# EasyEDA Pro project ProDocument_CENTER V1_2023-08-07.epro

# Schematic Schematic1_2
Create Date: 2023-04-20; Page Name: P1; Project Name: FS2040_NSPW_FN13101; Schematic Name: Schematic1_2; Update Date: 2023-05-19; Company: EASYEDA; Page Size: A3; Version: V1.0
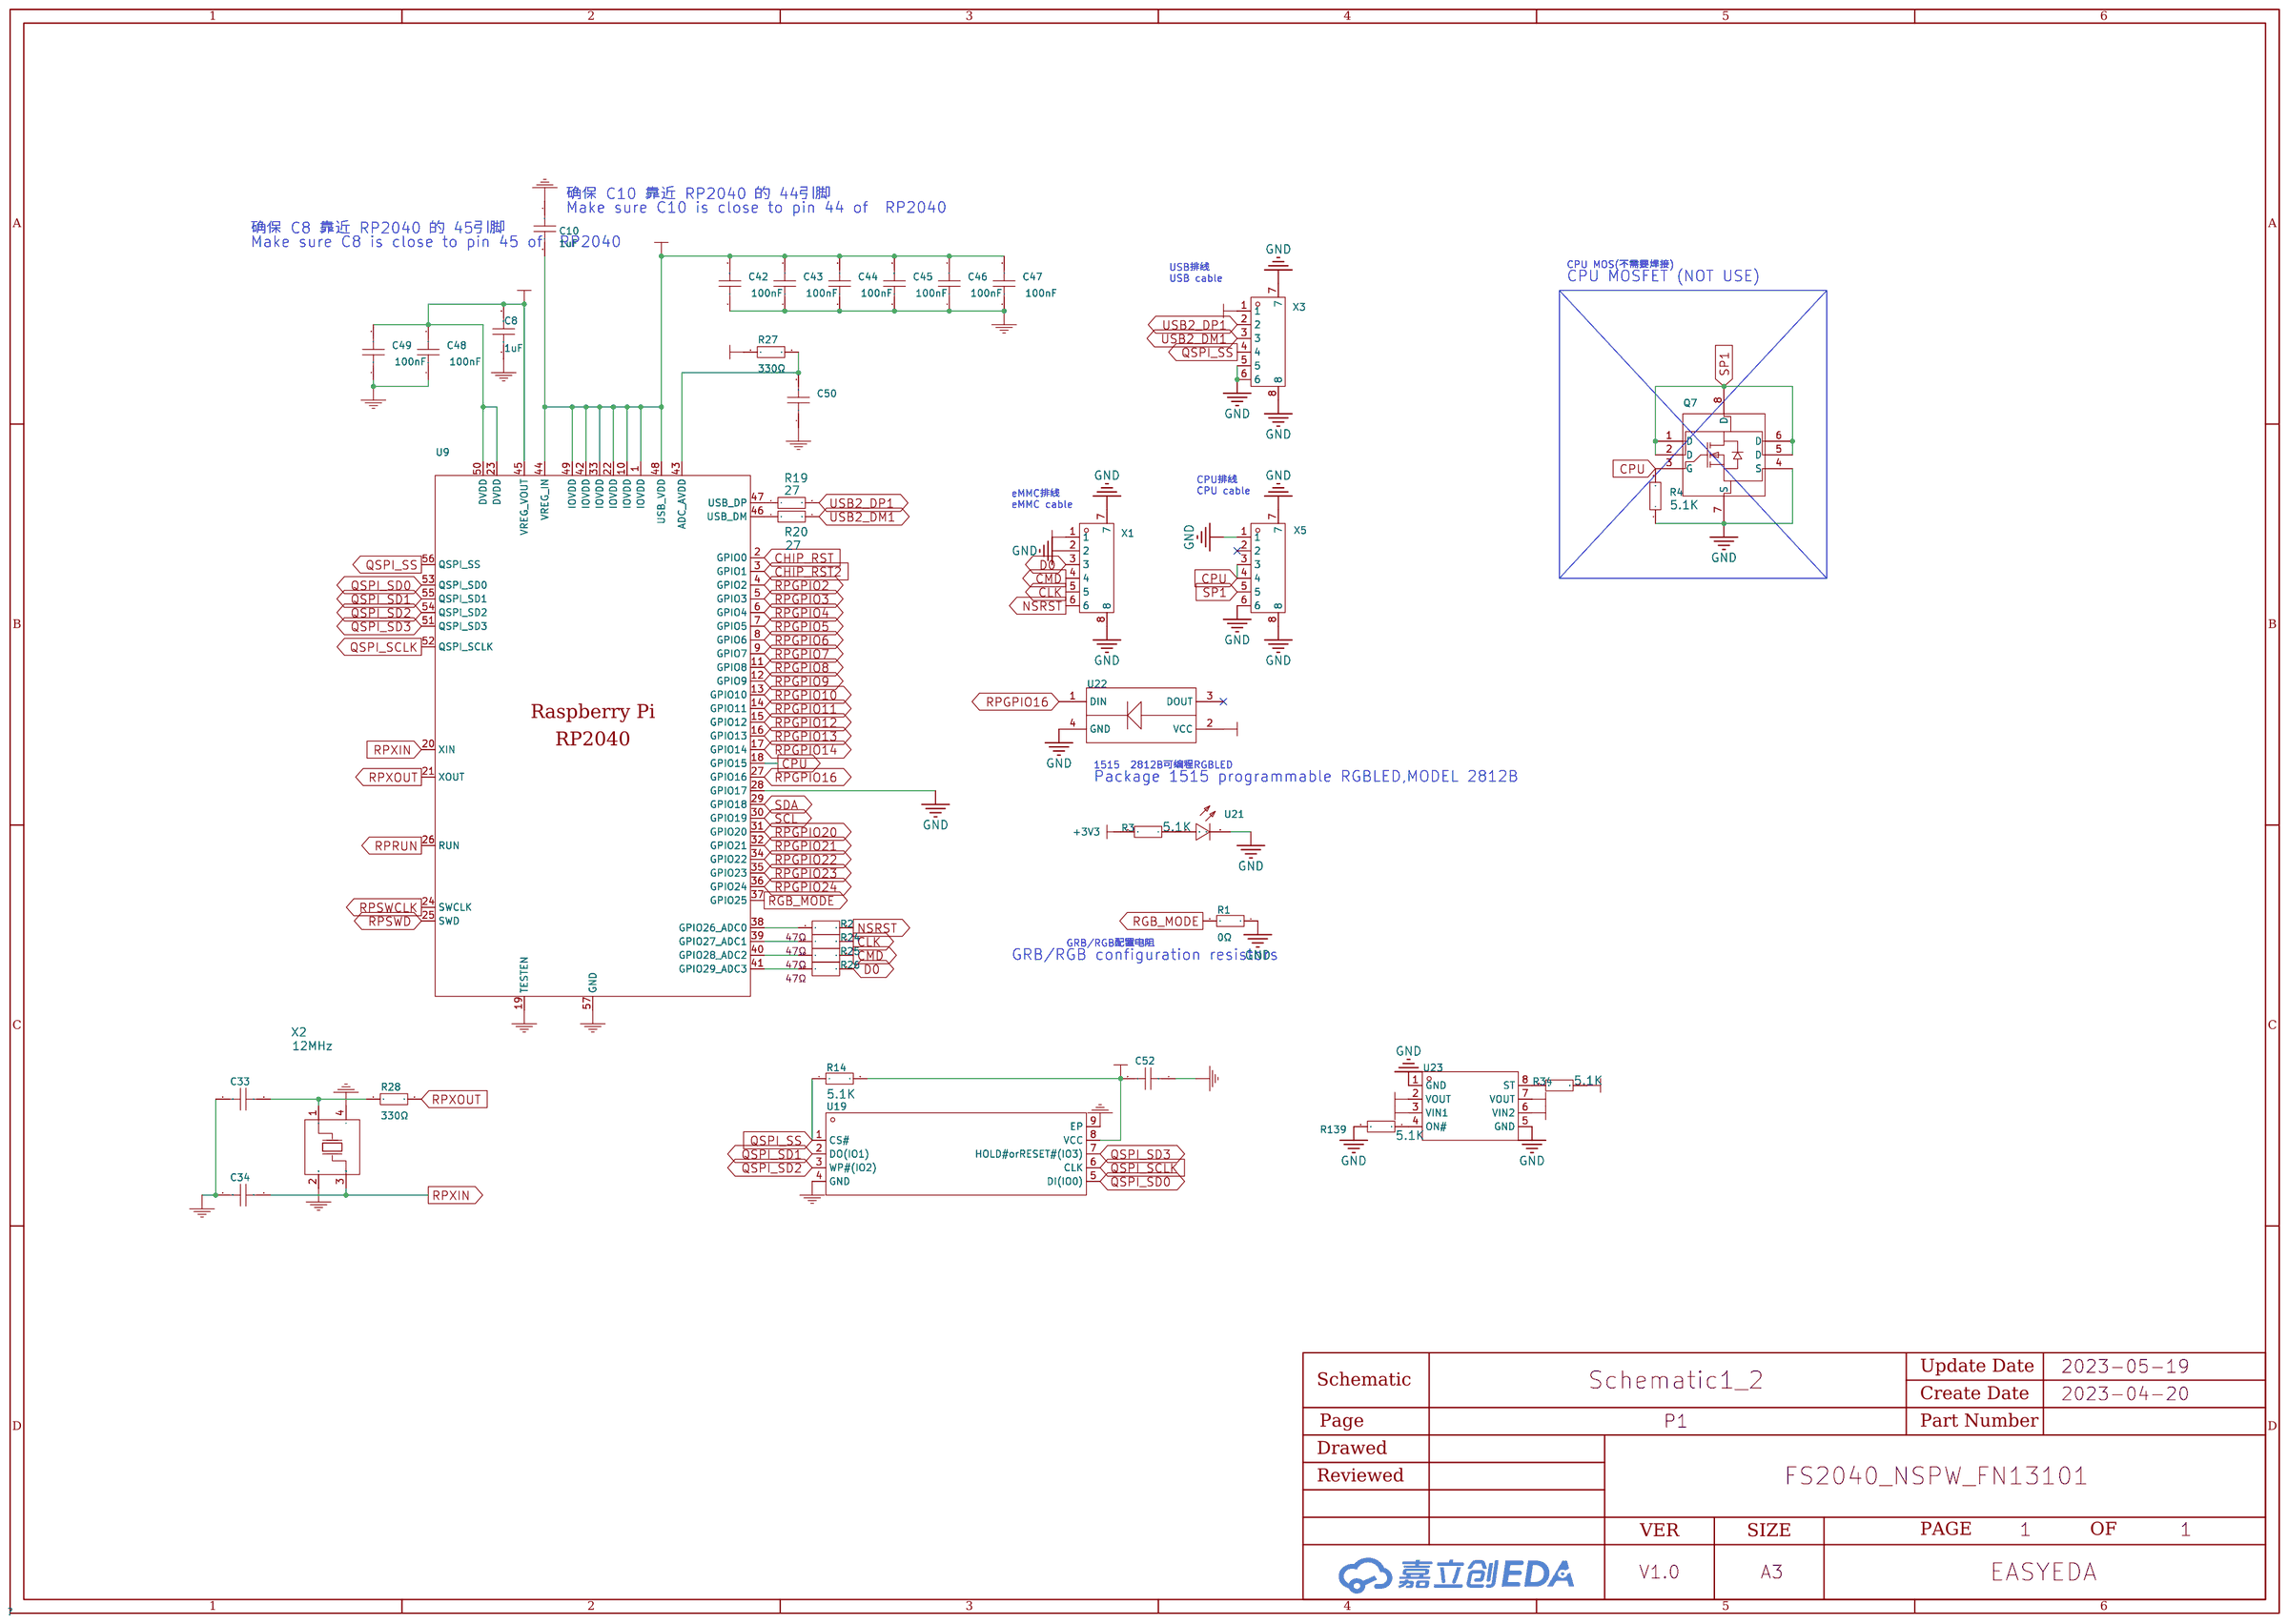
[diagram p0: schematic sheet]

## Parts
C8  1uF  [C0402_FS]
C10  1uF  [C0402_FS]
C33  27pF  [C0402_FS]
C34  27pF  [C0402_FS]
C42  100nF  [C0402_FS]
C43  100nF  [C0402_FS]
C44  100nF  [C0402_FS]
C45  100nF  [C0402_FS]
C46  100nF  [C0402_FS]
C47  100nF  [C0402_FS]
C48  100nF  [C0402_FS]
C49  100nF  [C0402_FS]
C50  100nF  [C0402_FS]
C52  100nF  [C0402_FS]
Q7  IRFHS8342TRPBF  [PQFN-8_L2.0-W2.0-P0.65_IRFHS8342TRPBF]
R1  0Ω  [0R跳线]
R2  ERJ2RKF47R0X  [R0402_FS]
R3  5.1K  [R0402_FS]
R4  5.1K  [R0402_FS]
R14  5.1K  [R0402_FS]
R19  27  [R0402_FS]
R20  27  [R0402_FS]
R24  ERJ2RKF47R0X  [R0402_FS]
R25  ERJ2RKF47R0X  [R0402_FS]
R26  ERJ2RKF47R0X  [R0402_FS]
R27  330Ω  [R0402_FS]
R28  330Ω  [R0402_FS]
R34  5.1K  [R0402_FS]
R139  5.1K  [R0402_FS]
U9  -  [RPI_RP2040]
U19  W25Q16JVUXIQ  [USON-8_L3.0-W2.0-P0.50-BL-EP]
U21  -  [LED 0603_RED]
U22  -  [1515RGB]
U23  LM66200DRLR  [SOT-583-8_L2.1-W1.2-P0.50-LS1.6-BL]
X1  FH34SRJ-6S-0.5SH(50)  [FFC-SMD_6P-P0.50_FH34SRJ-6S-0.5SH]
X2  12MHz  [OSC-SMD_4P-L3.2-W2.5-BL]
X3  FH34SRJ-6S-0.5SH(50)  [FFC-SMD_6P-P0.50_FH34SRJ-6S-0.5SH]
X5  FH34SRJ-6S-0.5SH(50)  [FFC-SMD_6P-P0.50_FH34SRJ-6S-0.5SH]

## Library data of the parts
C8 C10 = GRM155B30J105KE18D: Supplier: LCSC; Manufacturer: MuRata; Supplier Part: C85950
C33 C34 = CL05C270JB5NNNC: 容值:27pF;精度:±5%;额定电压:50V;材质(温度系数):C0G;; LCSC Part Name: 27pF ±5% 50V; Supplier Part: C86287; Manufacturer: SAMSUNG(三星); Supplier Footprint: 0402; JLCPCB Part Class: Extended Part; Datasheet: https://atta.szlcsc.com/upload/public/pdf/source/20181012/C86287_84E643B919F15D04554BF25D05EF9A53.pdf; Supplier: LCSC; Tolerance: ±5%; Voltage Rated: 50V; Temperature Coefficient: C0G
C42-C50 C52 = CC0402KRX7R5BB104: 温度系数:X7R;额定电压:6.3V;容值:100nF;电容体长:-;精度:±10%;电容体宽:-;电容体厚度:-;; LCSC Part Name: 100nF ±10% 6.3V; Supplier Part: C541406; Manufacturer: YAGEO(国巨); Supplier Footprint: 0402; JLCPCB Part Class: 扩展库; Datasheet: https://atta.szlcsc.com/upload/public/pdf/source/20200615/C541406_3B194383538E3D589FF46A58415A779C.pdf; Supplier: LCSC; Temperature Coefficient: X7R; Voltage Rated: 6.3V; Tolerance: ±10%
Q7 = IRFHS8342TRPBF: 类型:-;漏源电压(Vdss):-;连续漏极电流(Id):-;功率(Pd):-;导通电阻(RDS(on)@Vgs,Id):-;阈值电压(Vgs(th)@Id):-;栅极电荷(Qg@Vgs):-;输入电容(Ciss@Vds):-;反向传输电容(Crss@Vds):-;; Supplier Part: C537911; Manufacturer: Infineon(英飞凌); Supplier Footprint: PG-TSDSON-6; JLCPCB Part Class: Extended Part; Datasheet: https://atta.szlcsc.com/upload/public/pdf/source/20200522/C537911_B3BB2E0FBE18C9ED8D5A499E93241CA4.pdf; Supplier: LCSC
R1 = 0402WGF0000TCE: 电阻类型:厚膜电阻;阻值:0Ω;精度:±1%;功率:62.5mW;温度系数:±800ppm/℃;最大工作电压:50V;工作温度范围:-55℃~+155℃;; LCSC Part Name: 0Ω ±1% 62.5mW; Supplier Part: C17168; Manufacturer: UNI-ROYAL(厚声); Supplier Footprint: 0402; JLCPCB Part Class: 基础库; Datasheet: https://atta.szlcsc.com/upload/public/pdf/source/20200306/C422600_1E6D84923E4A46A82E41ADD87F860B5C.pdf; Supplier: LCSC; Type: 厚膜电阻; Tolerance: ±1%; Power(Watts): 62.5mW; Temperature Coefficient: ±800ppm/℃; Overload Voltage (Max): 50V; Operating Temperature Range: -55℃~+155℃
R2 R24-R26 = ERJ2RKF47R0X: LCSC Part Name: 47Ω; Supplier Part: C413056; Manufacturer: PANASONIC(松下); Supplier Footprint: 0402; JLCPCB Part Class: 扩展库; Datasheet: https://atta.szlcsc.com/upload/public/pdf/source/20190820/C413056_058CD750093394CDC09CF9CD7D90936D.pdf; Supplier: LCSC
R3 R4 R14 R34 R139 = RMC04025.1K1%N: 阻值:5.1kΩ;精度:±1%;功率:62.5mW;; LCSC Part Name: 5.1kΩ ±1% 62.5mW; Supplier Part: C325521; Manufacturer: Tyohm(幸亚电阻); Supplier Footprint: 0402; JLCPCB Part Class: Extended Part; Datasheet: https://atta.szlcsc.com/upload/public/pdf/source/20190115/C325521_1EC5F156994D781C7E2B08432302F19F.pdf; Supplier: LCSC; Tolerance: ±1%; Power(Watts): 62.5mW
R19 R20 = 0402WGF270JTCE: Supplier: LCSC; Manufacturer: UniOhm; Supplier Part: C25100; JLCPCB Part Class: Extended Part
R27 R28 = 0402WGF3300TCE: 阻值:330Ω;精度:±1%;功率:1/16W;温度系数:±100ppm/℃;最大工作电压:50V;工作温度范围:-55℃~+155℃;; LCSC Part Name: 330Ω ±1%; Supplier Part: C25104; Manufacturer: UNI-ROYAL(厚声); Supplier Footprint: 0402; JLCPCB Part Class: 基础库; Datasheet: https://atta.szlcsc.com/upload/public/pdf/source/20170920/C25104_1505901212369982735.pdf; Supplier: LCSC; Tolerance: ±1%; Power(Watts): 1/16W; Temperature Coefficient: ±100ppm/℃; Overload Voltage (Max): 50V; Operating Temperature Range: -55℃~+155℃
U9 = RPI_RP2040: Supplier: LCSC; Supplier Part: C2040; Manufacturer: Raspberry Pi(树莓派); Manufacturer Part: RP2040; JLCPCB Part Class: Extended Part
U19 = W25Q16JVUXIQ: Supplier Part: C2843335; Manufacturer: WINBOND(华邦); Supplier Footprint: USON-8; JLCPCB Part Class: 扩展库; Datasheet: https://atta.szlcsc.com/upload/public/pdf/source/20210629/C2843335_FB4D78B5076715625DC0C83F790D3044.pdf; Supplier: LCSC
U21 = LED 0603
U22 = 1515RGB
U23 = LM66200DRLR: Supplier Part: C3235556; Manufacturer: TI(德州仪器); Supplier Footprint: SOT-583; JLCPCB Part Class: Extended Part; Supplier: LCSC
X1 X3 X5 = FH34SRJ-6S-0.5SH(50): 间距:0.5mm;触点数量:6;锁定特性:-;安装类型:卧贴;触点类型:双侧触点/上下接;; Supplier Part: C224194; Manufacturer: HRS(广濑); Supplier Footprint: SMD; JLCPCB Part Class: Extended Part; Datasheet: https://atta.szlcsc.com/upload/public/pdf/source/20180712/C224194_08937A353F43080B85824A8384727686.pdf; Supplier: LCSC; Pitch: 0.5mm; Number of Contacts: 6; Mounting Type: 卧贴; Contact Type: 双侧触点/上下接; Height Above Board: 1mm; FFC, FCB Thickness: 0.3mm~0.3mm
X2 = -: Supplier: LCSC; Supplier Part: C362368; Manufacturer: Zhejiang Abel Elec; JLCPCB Part Class: Extended Part

## Nets
+1V1: C8.2 C48.2 C49.2 U9.23(DVDD) U9.45(VREG_VOUT) U9.50(DVDD)
+3V3: C10.2 C42.2 C43.2 C44.2 C45.2 C46.2 C47.2 C52.2 R3.2 R14.2 R27.1 U9.1(IOVDD) U9.10(IOVDD) U9.22(IOVDD) U9.33(IOVDD) U9.42(IOVDD) U9.44(VREG_IN) U9.48(USB_VDD) U9.49(IOVDD) U19.8(VCC) U22.2(VCC) U23.2(VOUT) U23.7(VOUT)
+3V3EMMC: R34.1 U23.3(VIN1) X1.1
+3V3INUSB: U23.6(VIN2) X3.1
GND: C8.1 C10.1 C33.2 C34.2 C42.1 C43.1 C44.1 C45.1 C46.1 C47.1 C48.1 C49.1 C50.1 C52.1 Q7.4(S) Q7.7(S) R1.1 R4.1 R139.2 U9.19(TESTEN) U9.28(GPIO17) U9.57(GND) U19.4(GND) U19.9(EP) U21.2(C) U22.4(GND) U23.1(GND) U23.5(GND) X1.2 X1.7 X1.8 X2.2 X2.4 X3.5 X3.6 X3.7 X3.8 X5.1 X5.6 X5.7 X5.8
CHIP_RST: U9.2(GPIO0)
CHIP_RST2: U9.3(GPIO1)
CLK: R24.2 X1.5
CMD: R25.2 X1.4
CPU: Q7.3(G) R4.2 U9.18(GPIO15) X5.3 X5.4
D0: R26.2 X1.3
NSRST: R2.2 X1.6
QSPI_SCLK: U9.52(QSPI_SCLK) U19.6(CLK)
QSPI_SD0: U9.53(QSPI_SD0) U19.5(DI(IO0))
QSPI_SD1: U9.55(QSPI_SD1) U19.2(DO(IO1))
QSPI_SD2: U9.54(QSPI_SD2) U19.3(WP#(IO2))
QSPI_SD3: U9.51(QSPI_SD3) U19.7(HOLD#orRESET#(IO3))
QSPI_SS: R14.1 U9.56(QSPI_SS) U19.1(CS#) X3.4
RGB_MODE: R1.2 U9.37(GPIO25)
RPGPIO2: U9.4(GPIO2)
RPGPIO3: U9.5(GPIO3)
RPGPIO4: U9.6(GPIO4)
RPGPIO5: U9.7(GPIO5)
RPGPIO6: U9.8(GPIO6)
RPGPIO7: U9.9(GPIO7)
RPGPIO8: U9.11(GPIO8)
RPGPIO9: U9.12(GPIO9)
RPGPIO10: U9.13(GPIO10)
RPGPIO11: U9.14(GPIO11)
RPGPIO12: U9.15(GPIO12)
RPGPIO13: U9.16(GPIO13)
RPGPIO14: U9.17(GPIO14)
RPGPIO16: U9.27(GPIO16) U22.1(DIN)
RPGPIO20: U9.31(GPIO20)
RPGPIO21: U9.32(GPIO21)
RPGPIO22: U9.34(GPIO22)
RPGPIO23: U9.35(GPIO23)
RPGPIO24: U9.36(GPIO24)
RPRUN: U9.26(RUN)
RPSWCLK: U9.24(SWCLK)
RPSWD: U9.25(SWD)
RPXIN: C34.1 U9.20(XIN) X2.3(OSC2)
RPXOUT: R28.1 U9.21(XOUT)
SCL: U9.30(GPIO19)
SDA: U9.29(GPIO18)
SP1: Q7.1(D) Q7.2(D) Q7.5(D) Q7.6(D) Q7.8(D) X5.5
USB2_DM1: R20.2 X3.3
USB2_DP1: R19.2 X3.2
$1N4246: C33.1 R28.2 X2.1(OSC1)
$1N4249: C50.2 R27.2 U9.43(ADC_AVDD)
$1N4262: R19.1 U9.47(USB_DP)
$1N4263: R20.1 U9.46(USB_DM)
$1N6328: R26.1 U9.41(GPIO29_ADC3)
$1N6330: R25.1 U9.40(GPIO28_ADC2)
$1N6332: R24.1 U9.39(GPIO27_ADC1)
$1N18439: R2.1 U9.38(GPIO26_ADC0)
$1N32117: R3.1 U21.1(A)
$1N46651: R139.1 U23.4(ON#)
$1N46695: R34.2 U23.8(ST)

Not connected (* = marked no-connect by the designer): U22 3(DOUT)*; X5 2*

## Notes on the sheet
- 确保 C10 靠近 RP2040 的 44引脚
- Make sure C10 is close to pin 44 of  RP2040
- 确保 C8 靠近 RP2040 的 45引脚
- Make sure C8 is close to pin 45 of  RP2040
- CPU MOS(不需要焊接)
- USB排线
  USB cable
- CPU MOSFET (NOT USE)
- CPU排线
  CPU cable
- eMMC排线
  eMMC cable
- 1515  2812B可编程RGBLED
- Package 1515 programmable RGBLED,MODEL 2812B
- GRB/RGB配置电阻
- GRB/RGB configuration resistors

# Board PCB1_2
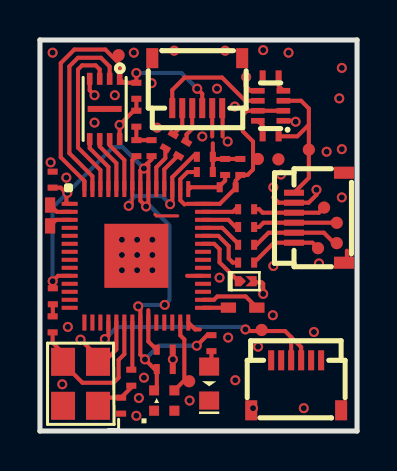
[diagram p1: board, top side]
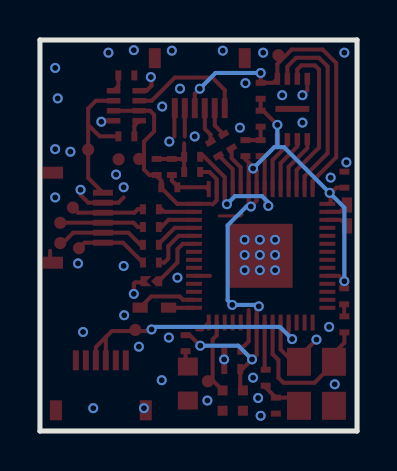
[diagram p2: board, bottom side, seen from below]

Outline 15.88 x 19.56 mm; copper layers: Top Layer, Bottom Layer. Coordinates in mm from the lower left corner of the outline.
Outline path: 0,19.56 0,0 15.88,0 15.88,19.56 0,19.56
Stack: Top Layer 0.035mm / Dielectric1 0.03mm FR4 er 4.5 / Bottom Layer 0.035mm

## Design rules (mm)
net $1N4262: DP1
net USB2_DP1: DP2
net $1N4263: DP1
net USB2_DM1: DP2
template: 用户自定义配置
spacing safeClearance (default): track to track 0.152, other pairs 0 to 0.3
track width trackWidth (default): min 0.127, default 0.254, max 2.54
differential pair differentialPair (default): width min 0.127, default 0.254, max 2.54; gap min 0.152, default 0.152
via viaSize (default): diameter min 0.5, default 0.61, max 10; hole min 0.3, default 0.305, max 5.999

## Placement (name value [footprint] x y rotation side)
C8  1uF  [C0402_FS]  8.26 13.72 180 top
C10  1uF  [C0402_FS]  8.26 12.95 180 top
C33  27pF  [C0402_FS]  4.06 1.27 270 top
C34  27pF  [C0402_FS]  0.64 5.33 90 top
C42  100nF  [C0402_FS]  0.64 12.57 270 top
C43  100nF  [C0402_FS]  0.65 6.74 90 top
C44  100nF  [C0402_FS]  10.03 13.21 270 top
C46  100nF  [C0402_FS]  6.25 3.1 180 top
C47  100nF  [C0402_FS]  5.59 14.15 270 top
C48  100nF  [C0402_FS]  6.25 4.06 180 top
C49  100nF  [C0402_FS]  4.83 14.15 270 top
C50  100nF  [C0402_FS]  9.27 13.21 270 top
C52  100nF  [C0402_FS]  4.83 15.62 90 top
NOREF  -  [Pad_e3163]  3.94 18.8 0 top
NOREF#2  -  [Pad_e3547]  13.92 9.14 0 top
NOREF#3  -  [Pad_e2963]  13.46 14.07 0 top
NOREF#4  -  [Pad_e3544]  14.22 11.18 0 top
NOREF#5  -  [Pad_e3545]  14.86 10.41 0 top
NOREF#6  -  [Pad_e2970]  11.94 13.59 0 top
NOREF#7  -  [Pad_e1245]  0.51 11.3 90 top
NOREF#8  -  [Pad_e2974]  7.47 2.49 0 top
NOREF#9  -  [Pad_e1214]  10.86 6.17 180 top
NOREF#10  -  [Pad_e1216]  9.44 6.17 180 top
NOREF#11  -  [Pad_e3546]  14.86 9.4 0 top
NOREF#12  -  [Pad_e2969]  10.91 13.61 0 top
NOREF#13  -  [Pad_e2972]  11.1 5.05 0 top
NOREF#14  -  [Pad_e1246]  0.51 10.26 90 top
R1  0Ω  [0R跳线]  10.29 7.49 180 top
R2  ERJ2RKF47R0X  [R0402_FS]  10.32 8.43 0 top
R3  5.1K  [R0402_FS]  8.59 4.39 90 top
R14  5.1K  [R0402_FS]  4.83 17.02 270 top
R19  27  [R0402_FS]  6.48 14.49 60 top
R20  27  [R0402_FS]  7.14 14.11 60 top
R24  ERJ2RKF47R0X  [R0402_FS]  10.32 9.31 0 top
R25  ERJ2RKF47R0X  [R0402_FS]  10.32 10.2 0 top
R26  ERJ2RKF47R0X  [R0402_FS]  10.32 11.09 0 top
R27  330Ω  [R0402_FS]  9.4 12.19 180 top
R28  330Ω  [R0402_FS]  4.57 2.67 270 top
R34  5.1K  [R0402_FS]  11.55 14.74 180 top
R139  5.1K  [R0402_FS]  11.55 17.79 180 top
U9  -  [RPI_RP2040]  4.83 8.76 0 top
U19  W25Q16JVUXIQ  [USON-8_L3.0-W2.0-P0.50-BL-EP]  3.24 16.11 180 top
U21  -  [LED 0603_RED]  8.47 2.37 270 top
U22  -  [1515RGB]  6.22 1.52 180 top
U23  LM66200DRLR  [SOT-583-8_L2.1-W1.2-P0.50-LS1.6-BL]  11.55 16.27 90 top
X1  FH34SRJ-6S-0.5SH(50)  [FFC-SMD_6P-P0.50_FH34SRJ-6S-0.5SH]  13.97 10.67 90 top
X2  12MHz  [OSC-SMD_4P-L3.2-W2.5-BL]  2.03 2.36 90 top
X3  FH34SRJ-6S-0.5SH(50)  [FFC-SMD_6P-P0.50_FH34SRJ-6S-0.5SH]  7.87 17.4 180 top
X5  FH34SRJ-6S-0.5SH(50)  [FFC-SMD_6P-P0.50_FH34SRJ-6S-0.5SH]  12.83 2.29 0 top

## Footprints (pads in the part's own frame, mm; a bottom-side part is the same pattern mirrored in y, then rotated)
0R跳线
  custom 0.559x0.508 smd: 1(-0.28,0) 2(0.254,0)
1515RGB
  rect 0.5x0.5 smd: 1(-0.508,-0.508) 2(0.508,-0.508) 3(0.508,0.508) 4(-0.508,0.508)
C0402_FS
  rect 0.3x0.5 smd: 1(-0.4,0) 2(0.4,0)
FFC-SMD_6P-P0.50_FH34SRJ-6S-0.5SH
  rect 0.3x1 smd: 1(1.25,1.25) 2(0.75,1.25) 3(0.25,1.25) 4(-0.25,1.25) 5(-0.75,1.25) 6(-1.25,1.25)
  rect 0.6x1 smd: 7(-2.25,-1.25) 8(2.25,-1.25)
LED 0603_RED
  rect 0.9x1 smd: 1(-0.85,0) 2(0.85,0)
OSC-SMD_4P-L3.2-W2.5-BL
  rect 1.4x1.2 smd: 1(-1.1,-0.875) 2(1.1,-0.875) 3(1.1,0.875) 4(-1.1,0.875)
Pad_e1214
  rect 0.762x0.508 smd: 1(0,0)
Pad_e1216
  rect 0.762x0.508 smd: 1(0,0)
Pad_e1245
  rect 0.762x0.508 smd: 1(0,0)
Pad_e1246
  rect 0.762x0.508 smd: 1(0,0)
Pad_e2963
  round 0.61 smd: TP1(0,0)
Pad_e2969
  round 0.61 smd: TP2(0,0)
Pad_e2970
  round 0.61 smd: TP3(0,0)
Pad_e2972
  round 0.61 smd: TP5(0,0)
Pad_e2974
  round 0.61 smd: TP7(0,0)
Pad_e3163
  round 0.61 smd: TP9(0,0)
Pad_e3544
  round 0.61 smd: TP11(0,0)
Pad_e3545
  round 0.61 smd: TP12(0,0)
Pad_e3546
  round 0.61 smd: TP13(0,0)
Pad_e3547
  round 0.61 smd: TP14(0,0)
R0402_FS
  rect 0.3x0.5 smd: 1(-0.4,0) 2(0.4,0)
RPI_RP2040
  rect 0.8x0.2 smd: 1(-3.338,2.6) 2(-3.338,2.2) 3(-3.338,1.8) 4(-3.338,1.4) 5(-3.338,1) 6(-3.338,0.6) 7(-3.338,0.2) 8(-3.338,-0.2) 9(-3.338,-0.6) 10(-3.338,-1) 11(-3.338,-1.4) 12(-3.338,-1.8) 13(-3.338,-2.2) 14(-3.338,-2.6) 29(3.338,-2.6) 30(3.338,-2.2) 31(3.338,-1.8) 32(3.338,-1.4) 33(3.338,-1) 34(3.338,-0.6) 35(3.338,-0.2) 36(3.338,0.2) 37(3.338,0.6) 38(3.338,1) 39(3.338,1.4) 40(3.338,1.8) 41(3.338,2.2) 42(3.338,2.6)
  rect 0.2x0.8 smd: 15(-2.6,-3.338) 16(-2.2,-3.338) 17(-1.8,-3.338) 18(-1.4,-3.338) 19(-1,-3.338) 20(-0.6,-3.338) 21(-0.2,-3.338) 22(0.2,-3.338) 23(0.6,-3.338) 24(1,-3.338) 25(1.4,-3.338) 26(1.8,-3.338) 27(2.2,-3.338) 28(2.6,-3.338) 43(2.6,3.338) 44(2.2,3.338) 45(1.8,3.338) 46(1.4,3.338) 47(1,3.338) 48(0.6,3.338) 49(0.2,3.338) 50(-0.2,3.338) 51(-0.6,3.338) 52(-1,3.338) 53(-1.4,3.338) 54(-1.8,3.338) 55(-2.2,3.338) 56(-2.6,3.338)
  rect 3.2x3.2 smd: 57(0,0)
SOT-583-8_L2.1-W1.2-P0.50-LS1.6-BL
  rect 0.28x0.68 smd: 1(-0.75,-0.64) 2(-0.25,-0.64) 3(0.25,-0.64) 4(0.75,-0.64) 5(0.75,0.64) 6(0.25,0.64) 7(-0.25,0.64) 8(-0.75,0.64)
USON-8_L3.0-W2.0-P0.50-BL-EP
  rect 0.28x0.6 smd: 1(-0.75,-1.506) 2(-0.249,-1.506) 3(0.249,-1.506) 4(0.75,-1.506) 5(0.75,1.509) 6(0.249,1.509) 7(-0.249,1.509) 8(-0.75,1.509)
  rect 1.7x0.299 smd: 9(0,0)

## Nets
+1V1: C8.2 C48.2 C49.2 U9.23 U9.45 U9.50
+3V3: C10.2 C42.2 C43.2 C44.2 C46.2 C47.2 C52.2 NOREF#12.TP2 R3.2 R14.2 R27.1 U9.1 U9.10 U9.22 U9.33 U9.42 U9.44 U9.48 U9.49 U19.8 U22.2 U23.2 U23.7
+3V3EMMC: NOREF#3.TP1 R34.1 U23.3 X1.1
+3V3INUSB: U23.6 X3.1
GND: C8.1 C10.1 C33.2 C34.2 C42.1 C43.1 C44.1 C46.1 C47.1 C48.1 C49.1 C50.1 C52.1 NOREF#6.TP3 R1.1 R139.2 U9.19 U9.28 U9.57 U19.4 U19.9 U21.2 U22.4 U23.1 U23.5 X1.2 X1.7 X1.8 X2.2 X2.4 X3.5 X3.6 X3.7 X3.8 X5.1 X5.6 X5.7 X5.8
CHIP_RST: NOREF#7.1 U9.2
CHIP_RST2: NOREF#14.1 U9.3
CLK: NOREF#11.TP13 R24.2 X1.5
CMD: NOREF#5.TP12 R25.2 X1.4
CPU: NOREF#13.TP5 U9.18 X5.3 X5.4
D0: NOREF#4.TP11 R26.2 X1.3
NSRST: NOREF#2.TP14 R2.2 X1.6
QSPI_SCLK: U9.52 U19.6
QSPI_SD0: U9.53 U19.5
QSPI_SD1: U9.55 U19.2
QSPI_SD2: U9.54 U19.3
QSPI_SD3: U9.51 U19.7
QSPI_SS: NOREF.TP9 R14.1 U9.56 U19.1 X3.4
RGB_MODE: R1.2 U9.37
RPGPIO2: U9.4
RPGPIO3: U9.5
RPGPIO4: U9.6
RPGPIO5: U9.7
RPGPIO6: U9.8
RPGPIO7: U9.9
RPGPIO8: U9.11
RPGPIO9: U9.12
RPGPIO10: U9.13
RPGPIO11: U9.14
RPGPIO12: U9.15
RPGPIO13: U9.16
RPGPIO14: U9.17
RPGPIO16: NOREF#8.TP7 U9.27 U22.1
RPGPIO20: U9.31
RPGPIO21: U9.32
RPGPIO22: U9.34
RPGPIO23: U9.35
RPGPIO24: U9.36
RPRUN: U9.26
RPSWCLK: U9.24
RPSWD: U9.25
RPXIN: C34.1 U9.20 X2.3
RPXOUT: R28.1 U9.21
SCL: NOREF#9.1 U9.30
SDA: NOREF#10.1 U9.29
SP1: X5.5
USB2_DM1: R20.2 X3.3
USB2_DP1: R19.2 X3.2
$1N4246: C33.1 R28.2 X2.1
$1N4249: C50.2 R27.2 U9.43
$1N4262: R19.1 U9.47
$1N4263: R20.1 U9.46
$1N6328: R26.1 U9.41
$1N6330: R25.1 U9.40
$1N6332: R24.1 U9.39
$1N18439: R2.1 U9.38
$1N32117: R3.1 U21.1
$1N46651: R139.1 U23.4
$1N46695: R34.2 U23.8

Pads without a net: U22 3; X5 2

## Via types
v1: diameter 0.5, hole 0.3, Top Layer to Bottom Layer, 70 vias

## Routing (per net, layer and track width the routed paths; a pad name or vN(x,y) marks a point on that pad's centre or on a via; arc(x,y) is an arc through that point)
+1V1: length 10.4
  Top Layer w0.152: 4.63,12.1 4.62,11.34 4.36,11.34
  Top Layer w0.203: v1(6.52,11.34) 6.63,11.45 U9.45 6.63,12.7 7.73,13.8 ; 5.85,4.07 5.84,4.07 5.43,4.48 U9.23 5.43,6.05 ; C49.2 4.63,13.55 4.63,12.06
  Bottom Layer w0.203: v1(4.44,11.26) 4.44,11.43 4.75,11.75 6.12,11.75 v1(6.52,11.34)
+3V3: length 50.4
  Top Layer w0.152: 6.9,10.76 5.83,10.76 5.75,10.84
  Top Layer w0.203: 7.37,11.36 U9.42 9,11.36 9.8,12.16 9.8,12.52 10.03,12.75 C44.2 10.4,12.81 10.67,13.08 10.67,14.48 10.16,14.99 10.16,15.82 10.36,16.02 U23.7 U23.2 ; 8.13,7.76 7.37,7.76 ; v1(4.92,6.24) 5.03,6.13 U9.22 5.03,3.81 v1(5.26,3.58) 5.74,3.1 5.85,3.1 5.85,2.17 U22.2 ; 5.36,13.36 5.43,13.3 U9.48 5.43,11.34 v1(5.31,11.23) 5.03,11.52 U9.49 5.03,13.03 5.36,13.36 ; 5.36,13.36 5.59,13.59 C47.2 ; U19.8 v1(3.99,15.31) 4.7,16.02 C52.2 R14.2 ; v1(7.85,4.27) 8.38,4.79 R3.2 ; C42.2 1.04,12.17 1.32,11.88 1.32,11.44 1.4,11.36 1.53,11.36 ; 7.73,12.95 7.39,12.95 7.03,12.59 U9.44 7.03,11.54 7.24,11.33 ; C43.2 0.64,7.15 v1(0.64,7.49) 0.91,7.76 1.53,7.76
  Bottom Layer w0.203: v1(5.21,13.13) 4.14,14.2 3.99,14.2 ; v1(4.92,6.24) 4.99,6.31 v1(6.25,6.31) 6.48,6.54 6.48,10.29 5.54,11.23 v1(5.31,11.23) ; 3.99,14.2 3.66,14.2 v1(1.37,11.91) 0.64,11.18 v1(0.64,7.49) ; 3.99,14.2 v1(3.99,15.31) ; v1(5.26,3.58) 5.94,4.27 v1(7.85,4.27)
+3V3EMMC: length 7.7
  Top Layer w0.203: U23.3 13.07,16.52 13.46,16.13 13.46,15.32 ; 13.46,15.32 12.88,14.74 R34.1 ; 13.46,15.32 NOREF#3.TP1 13.46,12.66 X1.1
+3V3INUSB: length 5.9
  Top Layer w0.203: X3.1 6.62,17.06 7.25,17.68 9.12,17.68 10.28,16.52 U23.6
GND: length 20.4
  Top Layer w0.203: 15.37,9.02 15.37,8.56 X1.7 ; C52.1 C49.1 C47.1 ; v1(2.73,16.8) 2.49,17.04 U19.4 ; 6.65,3.73 C48.1 ; 3.83,5.46 3.83,4.08 2.91,3.16 2.91,3.7 v1(2.03,4.57) ; 11.68,11.68 11.95,11.42 X1.2 13.45,11.42 13.84,11.81 v1(13.84,12.06) ; X3.5 8.62,14.73 ; C43.1 0.65,5.74 C34.2 ; 8.64,13.61 10.03,13.61 ; 8.64,13.61 8.66,13.63 8.66,14.39 ; 8.64,13.61 8.66,13.59 8.66,12.83 ; 10.76,7.49 10.82,7.44 11.11,7.44 11.18,7.37 v1(11.18,6.86) ; X3.6 9.14,16.13 9.14,14.73 ; 8,5.08 7.77,5.08 U9.28 ; U23.5 10.54,17.02 10.29,17.27 10.29,17.67 v1(10.32,17.7) ; U23.1 12.75,15.52 v1(12.8,15.47)
  vias: v1(0.53,13.44) v1(0.64,18.92) v1(1.12,2.34) v1(1.32,12.67) v1(1.4,5.21) v1(2.73,15.42) v1(3.75,16.8) v1(4.1,9.57) v1(4.1,8.8) v1(4.1,8.04) v1(4.7,18.92) v1(4.87,9.57) v1(4.87,8.8) v1(4.87,8.04) v1(4.83,0.76) v1(4.95,1.65) v1(5.21,2.67) v1(5.59,17.4) v1(5.63,9.57) v1(5.63,8.8) v1(5.63,8.04) v1(5.86,15.17) v1(6.66,3.58) v1(6.72,19.02) v1(7.49,1.52) v1(8.13,14.73) v1(8.86,17.12) v1(8.99,7.67) v1(9.27,19.02) v1(9.4,14.48) v1(9.42,4.67) v1(9.75,16.23) v1(9.78,2.54) v1(10.67,1.14) v1(10.92,4.22) v1(11.18,19.05) v1(11.68,12.19) v1(11.68,8.25) v1(11.66,5.79) v1(12.07,12.83) v1(12.45,18.92) v1(13.21,1.14) v1(13.72,4.95) v1(13.97,8.38) v1(14.35,13.97) v1(14.99,16.64) v1(15.11,18.16) v1(15.11,14.1) v1(15.11,11.68)
CHIP_RST: length 1.2
  Top Layer w0.203: 1.53,10.96 0.85,10.96 NOREF#7.1
CHIP_RST2: length 0.9
  Top Layer w0.203: 1.53,10.56 0.81,10.56 0.68,10.43
CLK: length 4.6
  Top Layer w0.203: NOREF#11.TP13 14.73,9.4 14.21,9.92 X1.5 11.44,9.92 10.84,9.31 R24.2
CMD: length 4.2
  Top Layer w0.203: NOREF#5.TP12 14.86,10.42 X1.4 11.19,10.42 10.98,10.2 R25.2
CPU: length 13.3
  Top Layer w0.203: 12.58,4.69 X5.4 ; 12.58,4.69 13.08,4.19 X5.3 ; 12.58,4.69 12.27,5 10.37,5 v1(10.29,5.08) ; v1(3.25,4.6) 3.27,4.6 3.43,4.75 3.43,5.46
  Bottom Layer w0.203: v1(10.29,5.08) 10.16,5.21 3.86,5.21 v1(3.25,4.6)
D0: length 3.7
  Top Layer w0.203: NOREF#4.TP11 13.97,10.92 X1.3 11.15,10.92 10.98,11.09 R26.2
NSRST: length 3.7
  Top Layer w0.203: R2.2 11.71,9.42 X1.6 13.65,9.42 NOREF#2.TP14
QSPI_SCLK: length 2.9
  Top Layer w0.203: U19.6 2.99,14.23 3.83,13.39 3.83,12.06
QSPI_SD0: length 2.9
  Top Layer w0.203: U19.5 2.49,14.15 3.43,13.21 3.43,12.06
QSPI_SD1: length 9.6
  Top Layer w0.203: U19.2 3.49,18.23 3.05,18.67 1.91,18.67 1.47,18.24 1.47,13.89 2.63,12.74 2.63,12.06
QSPI_SD2: length 8.2
  Top Layer w0.203: U19.3 2.99,18.08 2.79,18.29 2.11,18.29 1.91,18.08 1.91,14.17 3.03,13.05 3.03,12.06
QSPI_SD3: length 2.8
  Top Layer w0.203: 4.23,12.06 4.23,13.55 3.49,14.29 U19.7
QSPI_SS: length 17
  Top Layer w0.203: v1(7.87,17.12) 8.12,16.87 X3.4 ; 2.23,12.06 2.23,12.51 1.04,13.69 1.04,18.4 1.72,19.08 3.27,19.08 3.99,18.36 U19.1 4.19,17.42 R14.1 v1(4.83,17.91)
  Bottom Layer w0.203: v1(4.83,17.91) 7.09,17.91 v1(7.87,17.12)
RGB_MODE: length 3.1
  Top Layer w0.203: R1.2 9.93,7.49 8.99,8.43 8.99,9.09 8.72,9.36 8.13,9.36
RPGPIO16: length 3.7
  Top Layer w0.203: U22.1 7.23,2.53 7.23,4.58 7.03,4.78 7.03,5.46
RPXIN: length 8
  Top Layer w0.203: 0.64,4.93 0.64,4.42 1.16,3.89 1.16,3.39 2.13,2.41 3.68,2.41 3.94,2.67 3.94,3.56 4.23,3.84 4.23,5.46
RPXOUT: length 2.4
  Top Layer w0.203: R28.1 4.63,3.12 4.63,5.46
SCL: length 3
  Top Layer w0.203: U9.30 8.72,6.56 8.88,6.73 10.3,6.73 NOREF#9.1
SDA: length 1.3
  Top Layer w0.203: NOREF#10.1 9.43,6.16 U9.29
USB2_DM1: length 1.8
  Top Layer w0.203: X3.3 7.62,16.14 7.62,15.11 7.34,14.83 7.34,14.46
USB2_DP1: length 1.5
  Top Layer w0.203: X3.2 7.12,15.28 6.68,14.84
$1N4246: length 2.1
  Top Layer w0.203: 2.91,1.31 3.26,1.67 C33.1 4.57,2.18 R28.2
$1N4249: length 2.3
  Top Layer w0.203: C50.2 9.27,12.52 8.94,12.19 7.56,12.19 7.43,12.06
$1N4262: length 2.3
  Top Layer w0.203: 5.83,12.06 5.83,13.19 6.28,13.64 R19.1
$1N4263: length 2
  Top Layer w0.203: R20.1 6.9,13.76 6.23,13.09 6.23,12.06
$1N6328: length 1.8
  Top Layer w0.203: R26.1 9.8,11.09 9.67,10.96 8.13,10.96
$1N6330: length 1.9
  Top Layer w0.203: R25.1 9.79,10.2 9.44,10.56 8.13,10.56
$1N6332: length 2.2
  Top Layer w0.203: R24.1 9.92,9.37 9.13,10.16 8.13,10.16
$1N18439: length 2.7
  Top Layer w0.203: 8.13,9.76 8.93,9.76 9.45,9.25 9.45,8.63 9.65,8.43 R2.1
$1N32117: length 0.9
  Top Layer w0.203: 8.22,3.22 8.59,3.59 8.59,3.99
$1N46651: length 0.9
  Top Layer w0.203: R139.1 11.95,17.26 U23.4
$1N46695: length 0.9
  Top Layer w0.203: U23.8 11.15,15.28 R34.2

## Copper pours and planes (outline as drawn; the poured copper is in the pictures)
+1V1 on Top Layer: 1.69,11.98 4.74,11.98 4.74,10.33 3.21,10.33 3.21,7.15 5.63,7.15 5.63,5.63 1.69,5.63
+3V3 on Top Layer: 8.04,12.11 8.04,5.63 5.63,5.63 5.63,7.15 6.52,7.15 6.52,10.46 4.74,10.46 4.74,12.11
GND on Top Layer: -0.51,21.46 16.76,21.46 16.76,-2.54 -0.51,-2.54
GND on Bottom Layer: -0.63,21.59 16.64,21.59 16.64,-2.29 -0.63,-2.29
